# EAGLE schematic lis3dh v402 (EAGLE 9.6.2)
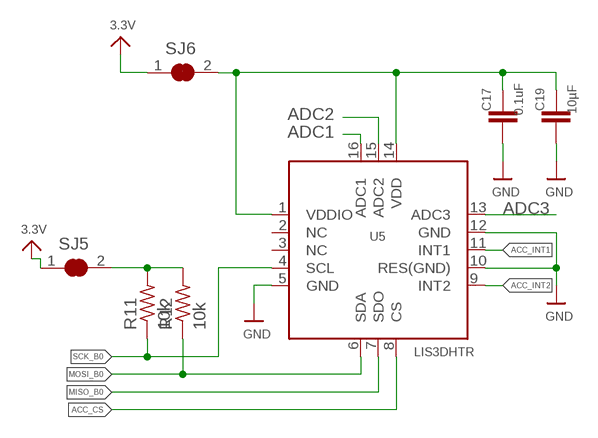
[diagram p0: schematic, sheet 1]

## Parts
C17  0.1uF  C-EUC0402  [C0402]
C19  10µF  C-EUC0402  [C0402]
R11  10k  R-US_R0402  [R0402]
R12  10k  R-US_R0402  [R0402]
SJ5  SOLDERJUMPER_CLOSED  [SOLDERJUMPER_CLOSEDWIRE]
SJ6  SOLDERJUMPER_CLOSED  [SOLDERJUMPER_CLOSEDWIRE]
U5  LIS3DHTR  ACCEL_LIS3DHTR  [LGA16_3X3MM]

## Nets
3.3V: SJ5.1 SJ6.1
ACC_CS: U5.8(CS)
ACC_INT1: U5.11(INT1)
ACC_INT2: U5.9(INT2)
ADC1: U5.16(ADC1)
ADC2: U5.15(ADC2)
ADC3: U5.13(ADC3)
GND: C17.2 C19.2 U5.5(GND) U5.10(RES(GND)) U5.12(GND)
MISO_B0: U5.7(SDO)
MOSI_B0: R12.1 U5.6(SDA)
N$2: R11.2 R12.2 SJ5.2
SCK_B0: R11.1 U5.4(SCL)
VDD: C17.1 C19.1 SJ6.2 U5.1(VDDIO) U5.14(VDD)
Unconnected: U5.2(NC) U5.3(NC)

## Library data of the parts
C17 C19 = rcl:C-EU: CAPACITOR, European symbol
R11 R12 = rcl-2:R-US_: RESISTOR, American symbol
SJ5 SJ6 = microbuilder:SOLDERJUMPER_CLOSED: Solder Jumper - Closed These solder jumpers are closed by default CLOSEDWIRE - 10 mil trace between pads that can be cut and resoldered later CLOSEDPERM - 63 mil trace between pads for a permanent connection (used to 'bridge' two signals, a shameless hack for Eagle). Can double as a test point as well (no cream layer)
U5 = microbuilder:ACCEL_LIS3DHTR: LIS3DHTR 3-Axis Accelerometer with I2C/SPI Interface VDD: 1.71-3.6V VDDIO: 1.71-VDD+0.1V Scale: +/-2g, 4g, 8g, 16g with 16--bit data output Temp:: -40°C - 85°C Mouser: 511-LIS3DHTR Digikey: 497-10613-1-ND